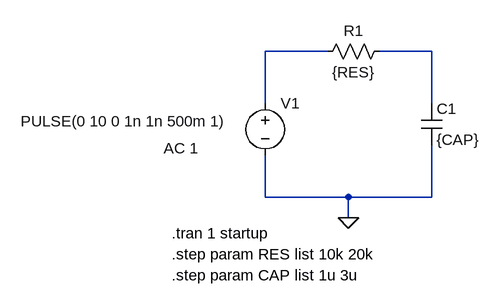
[diagram p0: schematic Draft2.asc]
Draft2.asc, the LTspice schematic file:
Version 4.1
SHEET 1 880 680
WIRE 224 16 128 16
WIRE 384 16 304 16
WIRE 128 96 128 16
WIRE 384 96 384 16
WIRE 128 240 128 176
WIRE 256 240 128 240
WIRE 384 240 384 160
WIRE 384 240 256 240
WIRE 256 272 256 240
FLAG 256 272 0
SYMBOL voltage 128 80 R0
WINDOW 3 -376 43 Left 2
WINDOW 123 -156 85 Left 2
WINDOW 39 0 0 Left 0
SYMATTR InstName V1
SYMATTR Value PULSE(0 10 0 1n 1n 500m 1)
SYMATTR Value2 AC 1
SYMBOL res 320 0 R90
WINDOW 0 0 56 VBottom 2
WINDOW 3 32 56 VTop 2
SYMATTR InstName R1
SYMATTR Value {RES}
SYMBOL cap 368 96 R0
SYMATTR InstName C1
SYMATTR Value {CAP}
TEXT -16 296 Left 2 !.tran 1 startup
TEXT -16 328 Left 2 !.step param RES list 10k 20k
TEXT -16 360 Left 2 !.step param CAP list 1u 3u

The netlist it stands for:
* Draft2.asc
V1 N001 0 PULSE(0 10 0 1n 1n 500m 1) AC 1
R1 N002 N001 {RES}
C1 N002 0 {CAP}
.tran 1 startup
.step param RES list 10k 20k
.step param CAP list 1u 3u
.backanno
.end